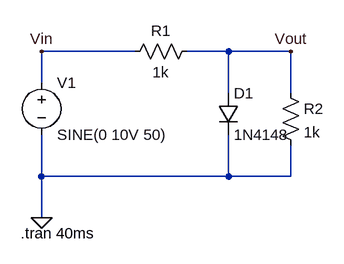
[diagram p0: schematic Assignment 3.3.asc]
Assignment 3.3.asc, the LTspice schematic file:
Version 4.1
SHEET 1 880 680
WIRE 176 80 32 80
WIRE 320 80 256 80
WIRE 416 80 320 80
WIRE 32 128 32 80
WIRE 320 144 320 80
WIRE 416 144 416 80
WIRE 32 272 32 208
WIRE 320 272 320 208
WIRE 320 272 32 272
WIRE 416 272 416 224
WIRE 416 272 320 272
WIRE 32 336 32 272
FLAG 32 80 Vin
FLAG 32 336 0
FLAG 416 80 Vout
SYMBOL voltage 32 112 R0
WINDOW 123 0 0 Left 0
WINDOW 39 0 0 Left 0
SYMATTR InstName V1
SYMATTR Value SINE(0 10V 50)
SYMBOL res 272 64 R90
WINDOW 0 0 56 VBottom 2
WINDOW 3 32 56 VTop 2
SYMATTR InstName R1
SYMATTR Value 1k
SYMBOL res 400 128 R0
SYMATTR InstName R2
SYMATTR Value 1k
SYMBOL diode 304 144 R0
SYMATTR InstName D1
SYMATTR Value 1N4148
TEXT 0 360 Left 2 !.tran 40ms

The netlist it stands for:
* Assignment 3.3.asc
V1 Vin 0 SINE(0 10V 50)
R1 Vout Vin 1k
R2 Vout 0 1k
D1 Vout 0 1N4148
.model D D
.lib standard.dio
.tran 40ms
.backanno
.end